# Altium schematic sheet neoPeak.SchDoc
size A2; SheetNumber: 1; SheetTotal: 1
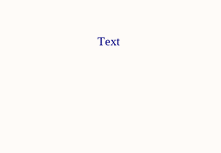
[diagram p0: neoPeak.SchDoc, top middle]
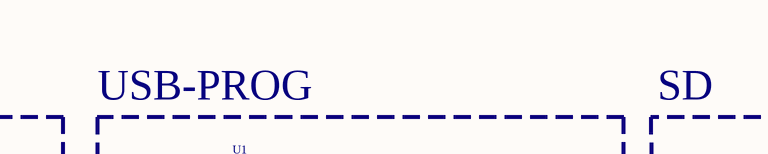
[diagram p1: neoPeak.SchDoc, top right]
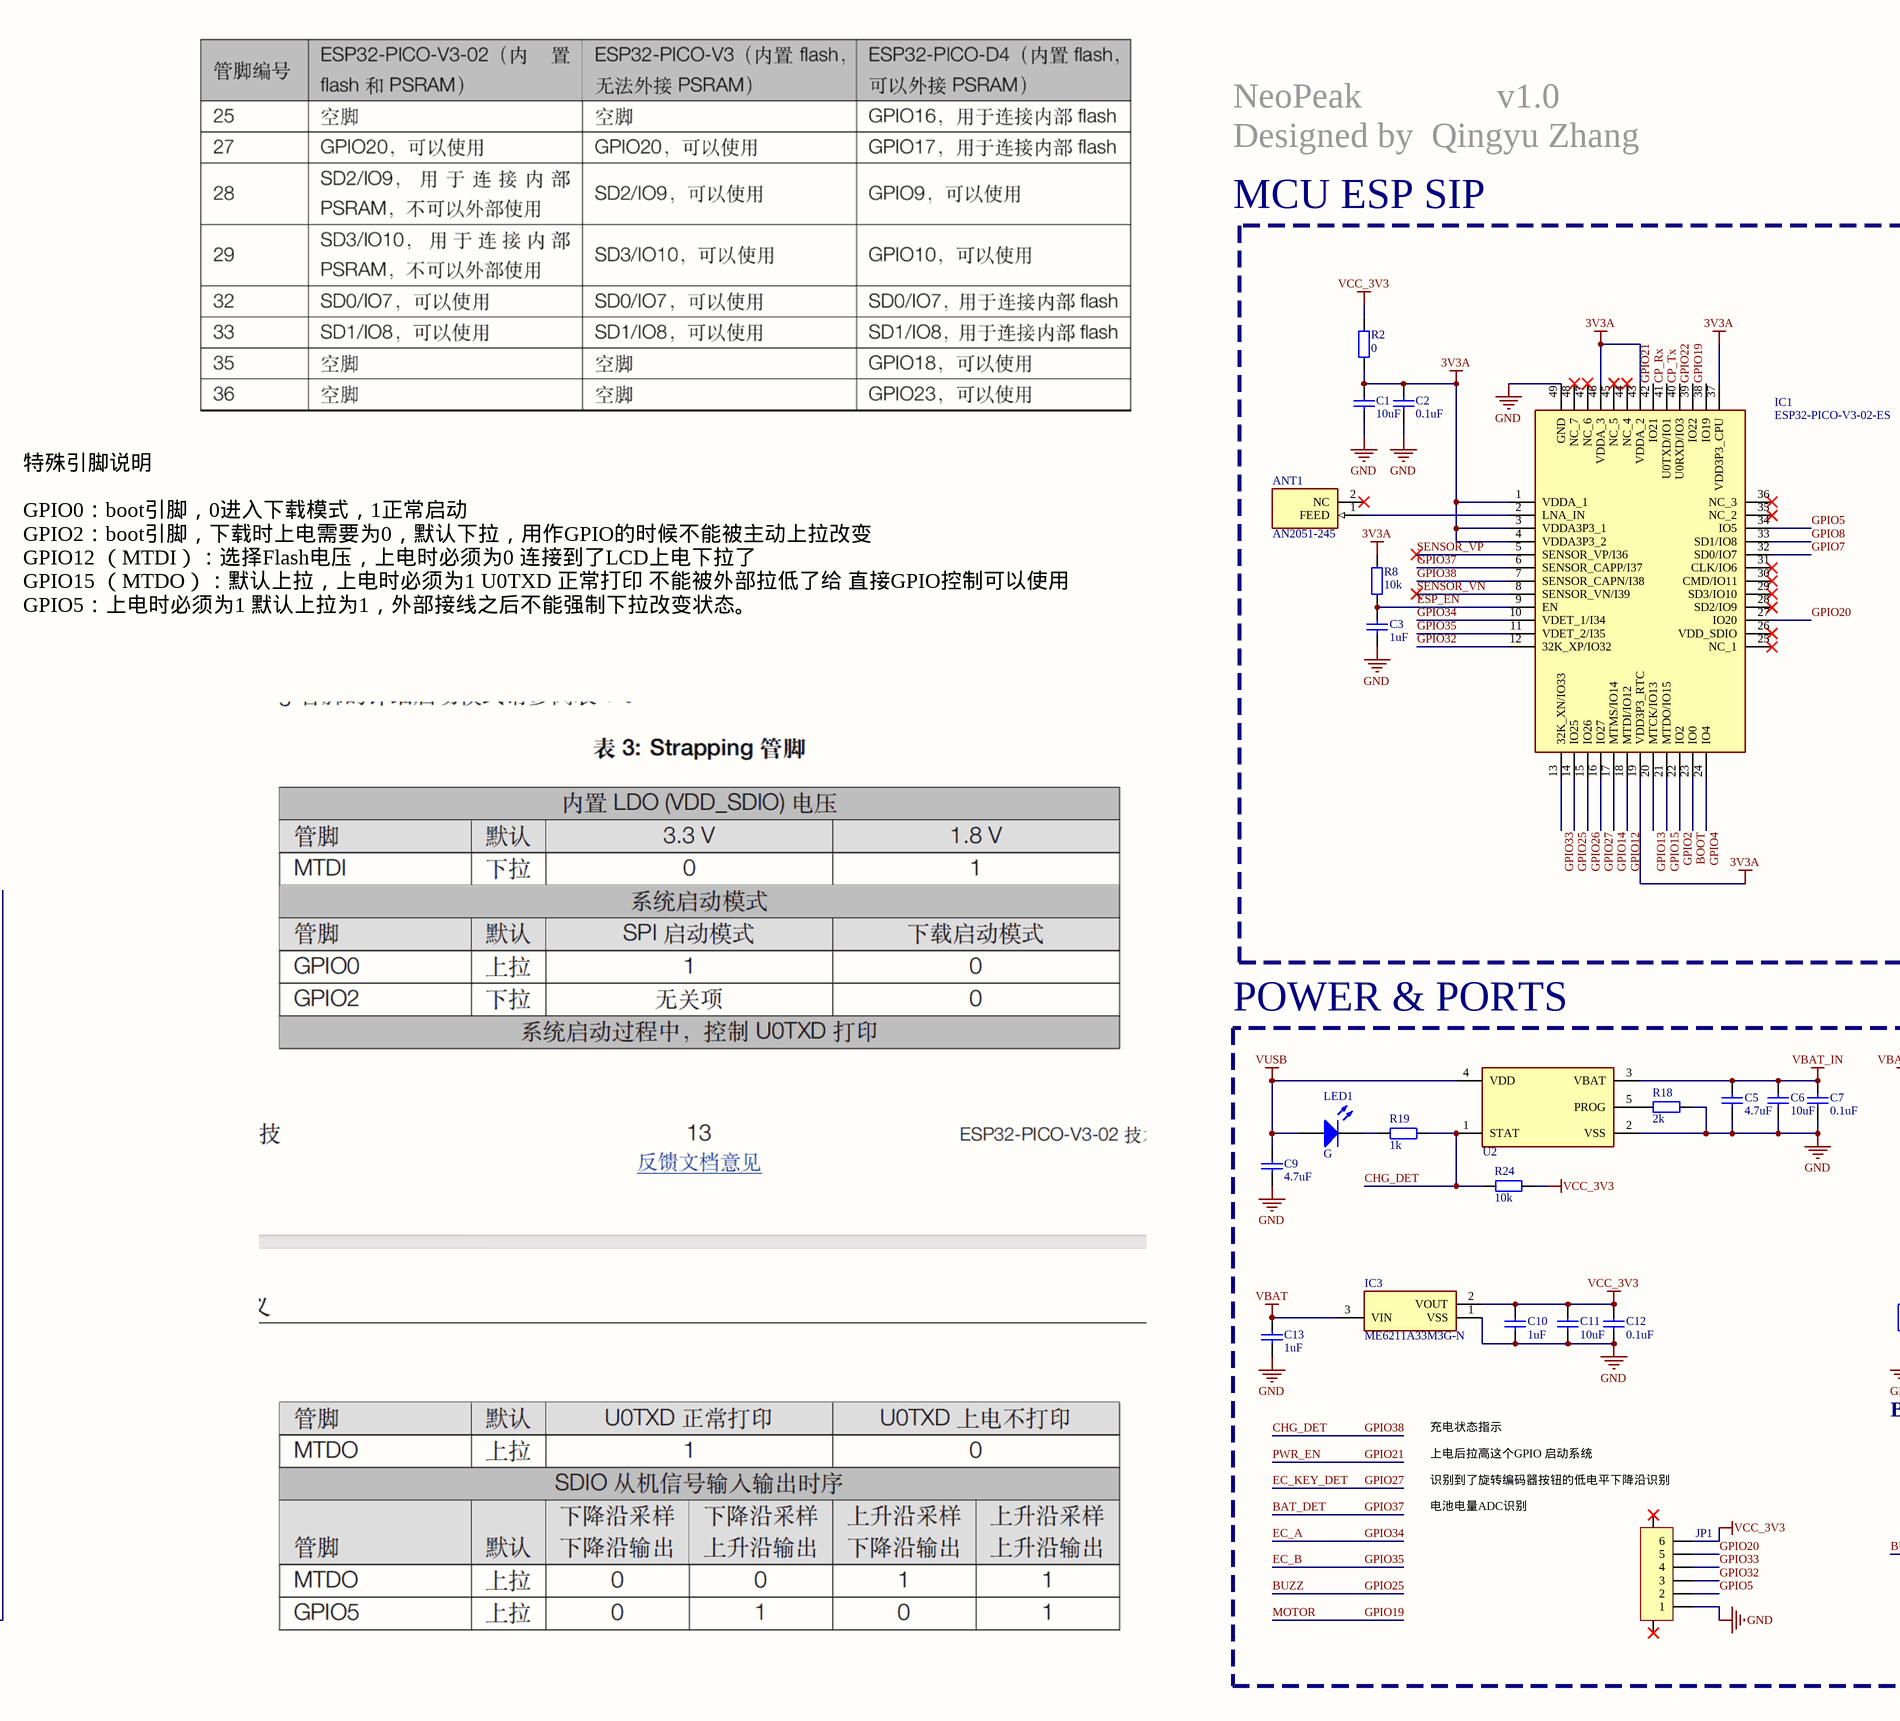
[diagram p2: neoPeak.SchDoc, bottom middle]
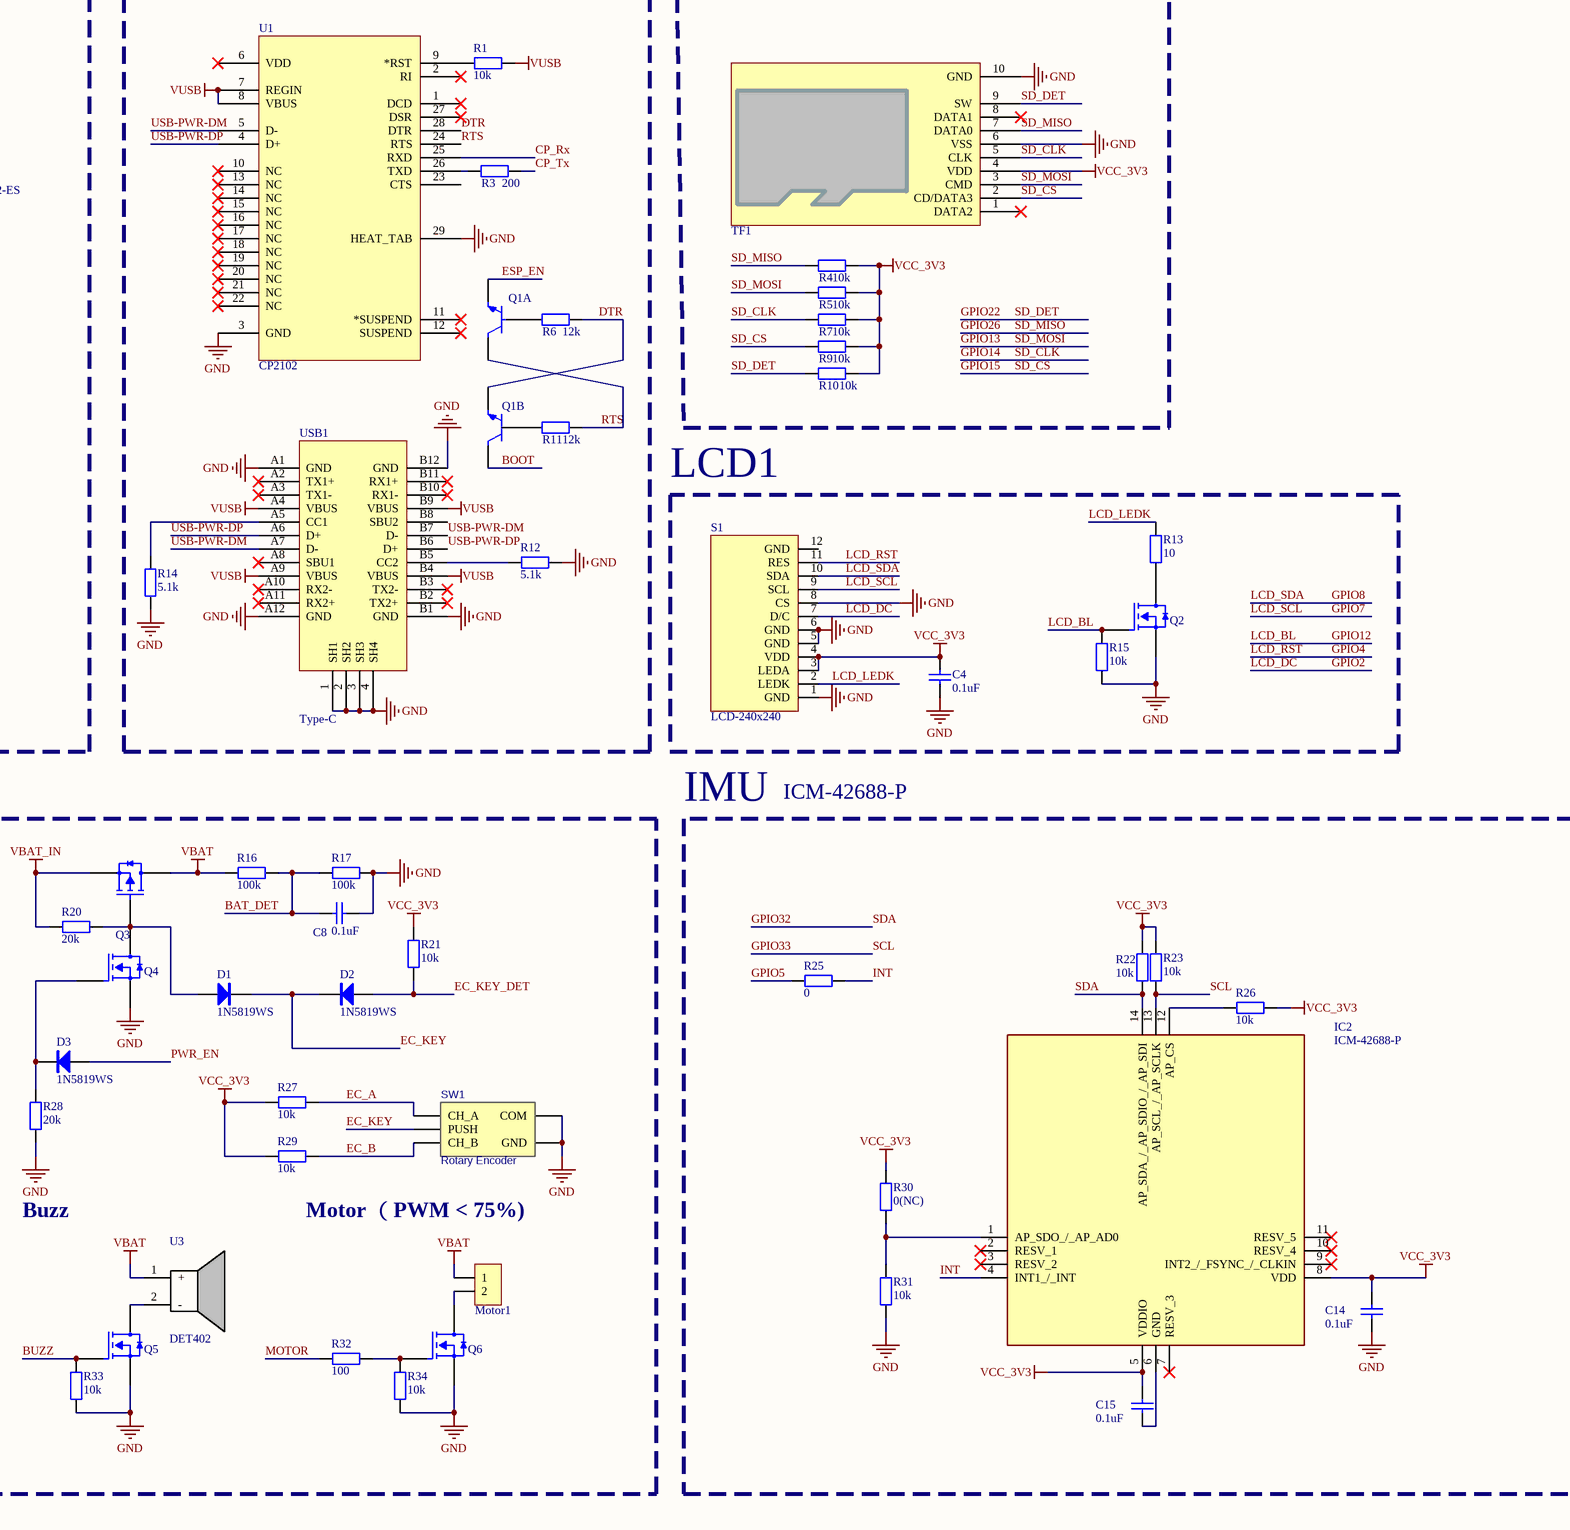
[diagram p3: neoPeak.SchDoc, bottom right]

## Parts
ANT1  AN2051-245  [ANTC5020X127N]
C1  10uF  [C0402_L]
C2  0.1uF  [C0402_L]
C3  1uF  [C0402_L]
C4  0.1uF  [C0402_L]
C5  4.7uF  [C0402_L]
C6  10uF  [C0402_L]
C7  0.1uF  [C0402_L]
C8  0.1uF  [C0402_L]
C9  4.7uF  [C0402_L]
C10  1uF  [C0402_L]
C11  10uF  [C0402_L]
C12  0.1uF  [C0402_L]
C13  1uF  [C0402_L]
C14  0.1uF  [C0402_L]
C15  0.1uF  [C0402_L]
D1  1N5819WS  [SOD-323]
D2  1N5819WS  [SOD-323]
D3  1N5819WS  [SOD-323]
IC1  ESP32-PICO-V3-02-ES  [ESP32PICOV302ES]
IC2  ICM-42688-P  [IIM42352]
IC3  ME6211A33M3G-N  [SOT95P280X145-3N]
JP1  CON-6P  [FPC0.5-WT-6P]  (value not drawn)
LED1  G  [LED0402_G]
Motor1  HDR-1X2  [HDR1.27-LI-2P]  (value not drawn)
Q1  BC847BVC-7  [SOT563-6]  (value not drawn)  (parts A,B of 2)
Q2  AO3400A  [SOT23-3]  (value not drawn)
Q3  AO3401A  [SOT23-3]  (value not drawn)
Q4  AO3400A  [SOT23-3]  (value not drawn)
Q5  AO3400A  [SOT23-3]  (value not drawn)
Q6  AO3400A  [SOT23-3]  (value not drawn)
R1  10k  [R0402_L]
R2  0  [R0402_L]
R3  200  [R0402_L]
R4  10k  [R0402_L]
R5  10k  [R0402_L]
R6  12k  [R0402_L]
R7  10k  [R0402_L]
R8  10k  [R0402_L]
R9  10k  [R0402_L]
R10  10k  [R0402_L]
R11  12k  [R0402_L]
R12  5.1k  [R0402_L]
R13  10  [R0402_L]
R14  5.1k  [R0402_L]
R15  10k  [R0402_L]
R16  100k  [R0402_L]
R17  100k  [R0402_L]
R18  2k  [R0402_L]
R19  1k  [R0402_L]
R20  20k  [R0402_L]
R21  10k  [R0402_L]
R22  10k  [R0402_L]
R23  10k  [R0402_L]
R24  10k  [R0402_L]
R25  0  [R0402_L]
R26  10k  [R0402_L]
R27  10k  [R0402_L]
R28  20k  [R0402_L]
R29  10k  [R0402_L]
R30  0(NC)  [R0402_L]
R31  10k  [R0402_L]
R32  100  [R0402_L]
R33  10k  [R0402_L]
R34  10k  [R0402_L]
S1  LCD-240x240  [LCD-240x240-FlUSH-154]
SW1  Rotary Encoder  [SIQ-02FVS3]
TF1  TF  [TF-SOCKET]  (value not drawn)
U1  CP2102  [QFN-28]
U2  MCP73831T  [SOT23-5]  (value not drawn)
U3  DET402  [DET402]
USB1  Type-C  [Type-C-TOP]

## Blocks framed on the sheet
USB-PROG: Q1 R1 R3 R6 R11 R12 R14 U1 USB1
SD: R4 R5 R7 R9 R10 TF1
POWER & PORTS: C5-C13 D1-D3 IC3 JP1 LED1 Motor1 Q3-Q6 R16-R21 R24 R27-R29 R32-R34 SW1 U2 U3
IMU: C14 C15 IC2 R22 R23 R25 R26 R30 R31

## Nets
3V3A: C1.2 C2.2 IC1.1(VDDA_1) IC1.3(VDDA3P3_1) IC1.4(VDDA3P3_2) IC1.19(VDD3P3_RTC) IC1.37(VDD3P3_CPU) IC1.43(VDDA_2) IC1.46(VDDA_3) R2.1 R8.2
GND: C1.1 C2.1 C3.1 C4.1 C5.1 C6.1 C7.1 C8.2 C9.1 C10.1 C11.1 C12.1 C13.1 C14.2 IC1.49(GND) IC3.1(VSS) JP1.1 Q2.2(S) Q4.2(S) Q5.2(S) Q6.2(S) R12.1 R14.2 R15.1 R17.2 R18.2 R28.1 R31.2 R33.2 R34.2 S1.1(GND) S1.5(GND) S1.6(GND) S1.8(CS) SW1.3(COM) SW1.5(GND) TF1.6(VSS) TF1.10(GND) U1.3(GND) U1.29(HEAT_TAB) U2.2(VSS) USB1.1(SH1) USB1.2(SH2) USB1.3(SH3) USB1.4(SH4) USB1.A1(GND) USB1.A12(GND) USB1.B1(GND) USB1.B12(GND)
VBAT: C13.2 IC3.3(VIN) Motor1.1 Q3.3(D) R16.1 U3.1(+)
VBAT_IN: C5.2 C6.2 C7.2 Q3.2(S) R20.1 U2.3(VBAT)
VCC_3V3: C4.2 C10.2 C11.2 C12.2 C14.1 C15.1 IC2.5(VDDIO) IC2.8(VDD) IC3.2(VOUT) JP1.6 R2.2 R4.1 R5.1 R7.1 R9.1 R10.1 R21.2 R22.1 R23.2 R24.2 R26.1 R27.1 R29.1 R30.1 S1.3(LEDA) S1.4(VDD) TF1.4(VDD)
VUSB: C9.2 LED1.1(A) R1.1 U1.7(REGIN) U1.8(VBUS) U2.4(VDD) USB1.A4(VBUS) USB1.A9(VBUS) USB1.B4(VBUS) USB1.B9(VBUS)
BAT_DET: C8.1 IC1.6(SENSOR_CAPP/I37) R16.2 R17.1  [also labelled GPIO37]
BOOT: IC1.23(IO0) Q1.3(C2)
BUZZ: IC1.14(IO25) Q5.1(G) R33.1  [also labelled GPIO25]
CHG_DET: IC1.7(SENSOR_CAPN/I38) R19.2 R24.1 U2.1(STAT)  [also labelled GPIO38]
CP_Rx: IC1.41(U0TXD/IO1) U1.25(RXD)
CP_Tx: IC1.40(U0RXD/IO3) R3.1
DTR: Q1.4(E2) R6.1 U1.28(DTR)
EC_A: IC1.10(VDET_1/I34) R27.2 SW1.1(CH_A)  [also labelled GPIO34]
EC_B: IC1.11(VDET_2/I35) R29.2 SW1.4(CH_B)  [also labelled GPIO35]
EC_KEY: D1.2(K) D2.2(K) SW1.2(PUSH)
EC_KEY_DET: D2.1(A) IC1.16(IO27) R21.1  [also labelled GPIO27]
ESP_EN: C3.2 IC1.9(EN) Q1.1(E1) R8.1
GPIO2: IC1.22(IO2) S1.7(D/C)  [also labelled LCD_DC]
GPIO4: IC1.24(IO4) S1.11(RES)  [also labelled LCD_RST]
GPIO5: IC1.34(IO5) JP1.2 R25.2
GPIO7: IC1.32(SD0/IO7) S1.9(SCL)  [also labelled LCD_SCL]
GPIO8: IC1.33(SD1/IO8) S1.10(SDA)  [also labelled LCD_SDA]
GPIO12: IC1.18(MTDI/IO12) Q2.1(G) R15.2  [also labelled LCD_BL]
GPIO13: IC1.20(MTCK/IO13) R5.2 TF1.3(CMD)  [also labelled SD_MOSI]
GPIO14: IC1.17(MTMS/IO14) R7.2 TF1.5(CLK)  [also labelled SD_CLK]
GPIO15: IC1.21(MTDO/IO15) R9.2 TF1.2(CD/DATA3)  [also labelled SD_CS]
GPIO19: IC1.38(IO19) R32.1  [also labelled MOTOR]
GPIO20: IC1.27(IO20) JP1.5
GPIO21: D3.1(A) IC1.42(IO21)  [also labelled PWR_EN]
GPIO22: IC1.39(IO22) R10.2 TF1.9(SW)  [also labelled SD_DET]
GPIO26: IC1.15(IO26) R4.2 TF1.7(DATA0)  [also labelled SD_MISO]
GPIO32: IC1.12(32K_XP/IO32) IC2.14(AP_SDA_/_AP_SDIO_/_AP_SDI) JP1.3 R22.2  [also labelled SDA]
GPIO33: IC1.13(32K_XN/IO33) IC2.13(AP_SCL_/_AP_SCLK) JP1.4 R23.1  [also labelled SCL]
INT: IC2.4(INT1_/_INT) R25.1
LCD_LEDK: R13.2 S1.2(LEDK)
RTS: Q1.6(C1) R11.1 U1.24(RTS)
SENSOR_VN: IC1.8(SENSOR_VN/I39)
SENSOR_VP: IC1.5(SENSOR_VP/I36)
USB-PWR-DM: U1.5(D-) USB1.A7(D-) USB1.B7(D-)
USB-PWR-DP: U1.4(D+) USB1.A6(D+) USB1.B6(D+)
NetANT1_1: ANT1.1(FEED) IC1.2(LNA_IN)
NetC15_2: C15.2 IC2.6(GND)
NetD1_1: D1.1(A) Q3.1(G) Q4.3(D) R20.2
NetD3_2: D3.2(K) Q4.1(G) R28.2
NetIC2_1: IC2.1(AP_SDO_/_AP_AD0) R30.2 R31.1
NetIC2_12: IC2.12(AP_CS) R26.2
NetLED1_2: LED1.2(K) R19.1
NetMotor1_2: Motor1.2 Q6.3(D)
NetQ1_2: Q1.2(B1) R6.2
NetQ1_5: Q1.5(B2) R11.2
NetQ2_3: Q2.3(D) R13.1
NetQ5_3: Q5.3(D) U3.2(-)
NetQ6_1: Q6.1(G) R32.2 R34.1
NetR1_2: R1.2 U1.9(*RST)
NetR3_2: R3.2 U1.26(TXD)
NetR12_2: R12.2 USB1.B5(CC2)
NetR14_1: R14.1 USB1.A5(CC1)
NetR18_1: R18.1 U2.5(PROG)

Not connected (* = marked no-connect by the designer): ANT1 2(NC)*; IC1 25(NC_1)* 26(VDD_SDIO)* 28(SD2/IO9)* 29(SD3/IO10)* 30(CMD/IO11)* 31(CLK/IO6)* 35(NC_2)* 36(NC_3)* 44(NC_4)* 45(NC_5)* 47(NC_6)* 48(NC_7)*; IC2 2(RESV_1)* 3(RESV_2)* 7(RESV_3)* 9(INT2_/_FSYNC_/_CLKIN)* 10(RESV_4)* 11(RESV_5)*; JP1 0*; S1 12(GND); TF1 1(DATA2)* 8(DATA1)*; U1 1(DCD)* 2(RI)* 6(VDD)* 10(NC)* 11(*SUSPEND)* 12(SUSPEND)* 13(NC)* 14(NC)* 15(NC)* 16(NC)* 17(NC)* 18(NC)* 19(NC)* 20(NC)* 21(NC)* 22(NC)* 23(CTS) 27(DSR)*; USB1 A2(TX1+)* A3(TX1-)* A8(SBU1)* A10(RX2-)* A11(RX2+)* B2(TX2+)* B3(TX2-)* B8(SBU2) B10(RX1-)* B11(RX1+)*

## Notes on the sheet
- Text
- NeoPeak               v1.0
  Designed by  Qingyu Zhang
- MCU ESP SIP
- 特殊引脚说明
  GPIO0：boot引脚，0进入下载模式，1正常启动
  GPIO2：boot引脚，下载时上电需要为0，默认下拉，用作GPIO的时候不能被主动上拉改变
  GPIO12 （MTDI）：选择Flash电压，上电时必须为0 连接到了LCD上电下拉了
  GPIO15 （MTDO）：默认上拉，上电时必须为1 U0TXD 正常打印 不能被外部拉低了给 直接GPIO控制可以使用
  GPIO5：上电时必须为1 默认上拉为1，外部接线之后不能强制下拉改变状态。
- LCD1
- ICM-42688-P
- 充电状态指示
- Buzz
- Motor （PWM < 75%)
- 上电后拉高这个GPIO 启动系统
- (near JP1) 识别到了旋转编码器按钮的低电平下降沿识别
- 电池电量ADC识别

## Library data of the parts
ANT1 = AN2051-245: Antenna; Manufacturer_Name: RAINBOW SW INDUSTRY  CO.,LIMITED; Datasheet Link: https://www.micros.com.pl/mediaserver/info-rf%20an2051-245.pdf; Height: 1.27mm; Manufacturer_Part_Number: AN2051-245
C1-C15 = C: 贴片电容/MLCC电容; BOM名称: 无极性贴片电容; 联系下单店铺卖家 免费帮你查找封装: 联系下单店铺卖家 免费技术指导; 当前库版本V2024.2.3 @淘宝卖家:黄晶宝石: 最新版本发布https://item.taobao.com/item.htm?id=566775463719
D1-D3 = 1N5819: 肖特基二极管; 版权归属: 源创客; 属性: 40V/2A; BOM名称: 肖特基二极管; 学习资源: www.ooocke.com
IC1 = ESP32-PICO-V3-02-ES: Integrated Circuit; Manufacturer_Name: Espressif Systems; Datasheet Link: https://www.espressif.com/sites/default/files/documentation/esp32-pico-v3-02_datasheet_en.pdf; Height: 1.21mm; Manufacturer_Part_Number: ESP32-PICO-V3-02-ES
IC2 = ICM-42688-P: Integrated Circuit; Manufacturer_Name: TDK; Datasheet Link: https://3cfeqx1hf82y3xcoull08ihx-wpengine.netdna-ssl.com/wp-content/uploads/2021/06/DS-000347-ICM-42688-P-v1.5.pdf; Manufacturer_Part_Number: ICM-42688-P; Mouser Part Number: 410-ICM-42688-P; Mouser Price/Stock: https://www.mouser.co.uk/ProductDetail/TDK-InvenSense/ICM-42688-P?qs=OlC7AqGiEDk8QrNAV728zw%3D%3D; Arrow Part Number: ICM-42688-P; Arrow Price/Stock: https://www.arrow.com/en/products/icm-42688-p/invensense?utm_currency=USD&region=nac
IC3 = ME6211A33M3G-N: Integrated Circuit; Manufacturer_Name: Microne; Datasheet Link: https://www.lcsc.com/datasheet/lcsc_datasheet_1811151641_MICRONE-Nanjing-Micro-One-Elec-ME6211A33M3G-N_C168807.pdf; Height: 1.45mm; Manufacturer_Part_Number: ME6211A33M3G-N
JP1 = Header 6: 6P连接器; 封装库来自淘宝卖家: 黄晶宝石: 最新版本发布https://shop463601444.taobao.com; BOM名称: 6P连接器
LED1 = LED: 贴片LED; 封装库来自淘宝卖家：黄晶宝石: 其他店铺购入均为盗版封装库，无更新权益，请立即申请退款，本店现金奖励200~1000元; BOM名称: 贴片LED
Motor1 = Header 2: 2P连接器; 联系卖家 免费查找封装: 唯一出售店铺网址https://shop463601444.taobao.com; BOM名称: 2P连接器
Q2 Q4-Q6 = AO3400A: N-MOS
Q3 = AO3401A: P-MOS
R1-R34 = R: 贴片电阻; 联系下单店铺卖家 免费帮你查找封装: 联系下单店铺卖家 免费技术指导; BOM名称: 贴片电阻
S1 = LCD-240x240: 显示屏
SW1 = Rotary Encoder: BOM_Manufacturer: ALPSALPINE; BOM_Manufacturer Part: EC11E1534443; Contributor: LCSC; BOM_Supplier: LCSC; BOM_Supplier Part: C1322543; BOM_JLCPCB Part Class: Extended Part; spicePre: S; spiceSymbolName: EC11E1534443
TF1 = TF卡座: 8脚自弹
U1 = CP2102: USB转TTL; PART DESC: SINGLE-CHIP USB TO UART BRIDGE, QFN28, RoHS.; MFG #1: SILICON LABS; PART NUMBER: CP2102; Value: Value; RefDes: RefDes; Type: DEV
USB1 = USB-Type-C-TOP